# Altium schematic sheet IRComms.SchDoc
size A
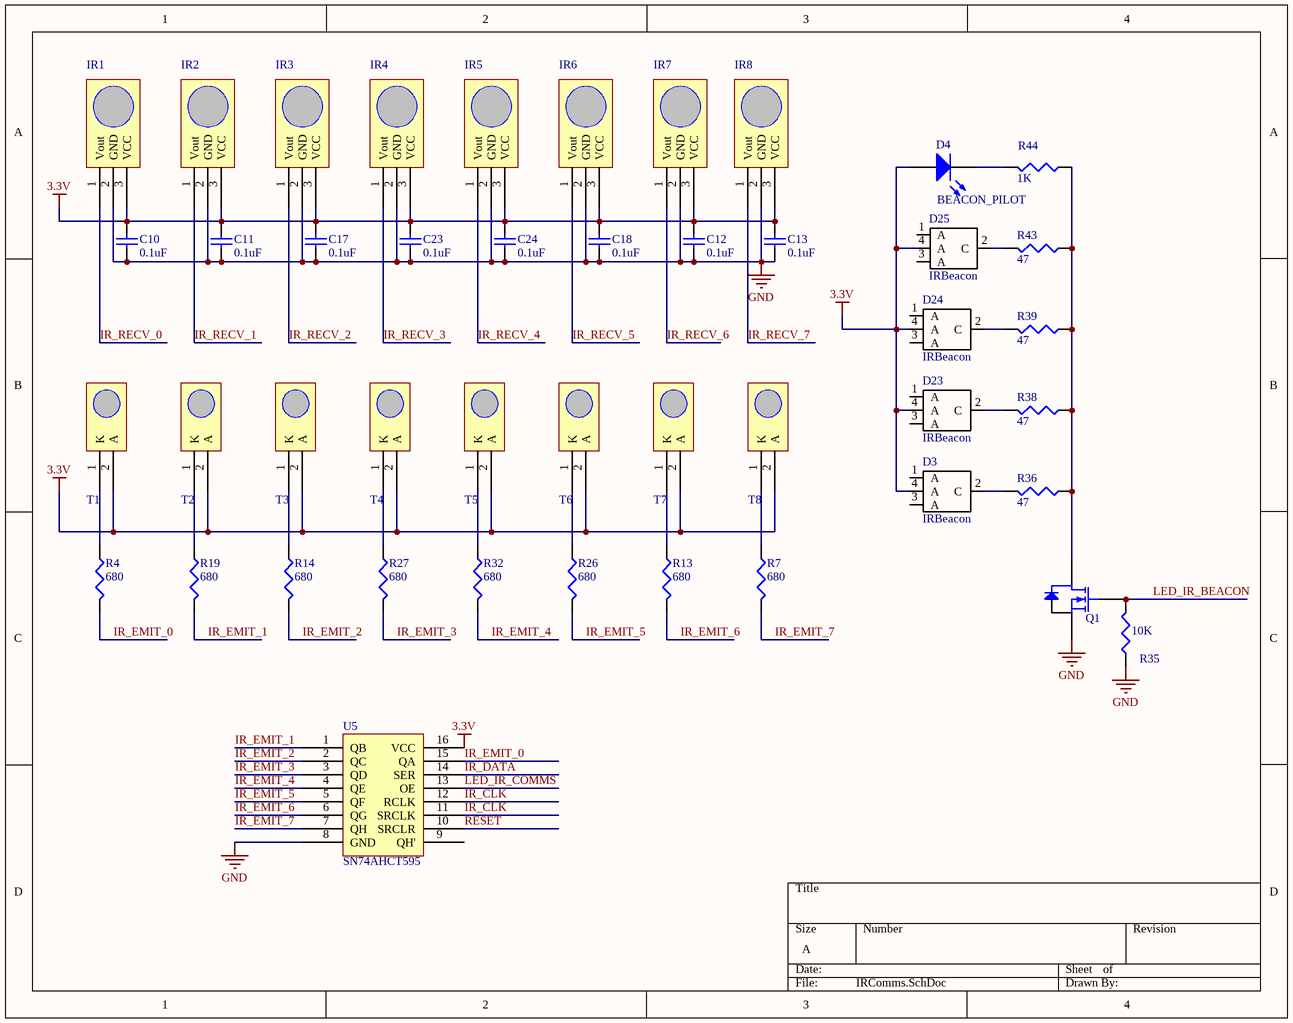
[diagram p0: IRComms.SchDoc]

## Parts
C10  value 0.1uF  [CAPC1005L]  (hidden comment: Cap Semi)
C11  value 0.1uF  [CAPC1005L]  (hidden comment: Cap Semi)
C12  value 0.1uF  [CAPC1005L]  (hidden comment: Cap Semi)
C13  value 0.1uF  [CAPC1005L]  (hidden comment: Cap Semi)
C17  value 0.1uF  [CAPC1005L]  (hidden comment: Cap Semi)
C18  value 0.1uF  [CAPC1005L]  (hidden comment: Cap Semi)
C23  value 0.1uF  [CAPC1005L]  (hidden comment: Cap Semi)
C24  value 0.1uF  [CAPC1005L]  (hidden comment: Cap Semi)
D3  IRBeacon  [IRBeacon]
D4  BEACON_PILOT  [SurfaceMount(603)]
D23  IRBeacon  [IRBeacon]
D24  IRBeacon  [IRBeacon]
D25  IRBeacon  [IRBeacon]
IR1  GP1UX31QS  [GP1UX31QS]  (value not drawn)
IR2  GP1UX31QS  [GP1UX31QS]  (value not drawn)
IR3  GP1UX31QS  [GP1UX31QS]  (value not drawn)
IR4  GP1UX31QS  [GP1UX31QS]  (value not drawn)
IR5  GP1UX31QS  [GP1UX31QS]  (value not drawn)
IR6  GP1UX31QS  [GP1UX31QS]  (value not drawn)
IR7  GP1UX31QS  [GP1UX31QS]  (value not drawn)
IR8  GP1UX31QS  [GP1UX31QS]  (value not drawn)
Q1  Mosfet  [SOT-23]  (value not drawn)
R4  value 680  [RESC1608L]  (hidden comment: Res3)
R7  value 680  [RESC1608L]  (hidden comment: Res3)
R13  value 680  [RESC1608L]  (hidden comment: Res3)
R14  value 680  [RESC1608L]  (hidden comment: Res3)
R19  value 680  [RESC1608L]  (hidden comment: Res3)
R26  value 680  [RESC1608L]  (hidden comment: Res3)
R27  value 680  [RESC1608L]  (hidden comment: Res3)
R32  value 680  [RESC1608L]  (hidden comment: Res3)
R35  value 10K  [RESC1608L]  (hidden comment: Res3)
R36  value 47  [RESC1608L]  (hidden comment: Res3)
R38  value 47  [RESC1608L]  (hidden comment: Res3)
R39  value 47  [RESC1608L]  (hidden comment: Res3)
R43  value 47  [RESC1608L]  (hidden comment: Res3)
R44  value 1K  [RESC1608L]  (hidden comment: Res3)
T1  LN54  [LN54]  (value not drawn)
T2  LN54  [LN54]  (value not drawn)
T3  LN54  [LN54]  (value not drawn)
T4  LN54  [LN54]  (value not drawn)
T5  LN54  [LN54]  (value not drawn)
T6  LN54  [LN54]  (value not drawn)
T7  LN54  [LN54]  (value not drawn)
T8  LN54  [LN54]  (value not drawn)
U5  SN74AHCT595  [TSOP65P640X120-16N]

## Nets
3.3V: C10.2 C11.2 C12.2 C13.2 C17.2 C18.2 C23.2 C24.2 D3.4(A) D4.1(A) D23.4(A) D24.4(A) D25.4(A) IR1.3(VCC) IR2.3(VCC) IR3.3(VCC) IR4.3(VCC) IR5.3(VCC) IR6.3(VCC) IR7.3(VCC) IR8.3(VCC) T1.2(A) T2.2(A) T3.2(A) T4.2(A) T5.2(A) T6.2(A) T7.2(A) T8.2(A) U5.16(VCC)
GND: C10.1 C11.1 C12.1 C13.1 C17.1 C18.1 C23.1 C24.1 IR1.2(GND) IR2.2(GND) IR3.2(GND) IR4.2(GND) IR5.2(GND) IR6.2(GND) IR7.2(GND) IR8.2(GND) Q1.2(S) R35.1 U5.8(GND)
IR_CLK: U5.11(SRCLK) U5.12(RCLK)
IR_DATA: U5.14(SER)
IR_EMIT_0: R4.2 U5.15(QA)
IR_EMIT_1: R19.2 U5.1(QB)
IR_EMIT_2: R14.2 U5.2(QC)
IR_EMIT_3: R27.2 U5.3(QD)
IR_EMIT_4: R32.2 U5.4(QE)
IR_EMIT_5: R26.2 U5.5(QF)
IR_EMIT_6: R13.2 U5.6(QG)
IR_EMIT_7: R7.2 U5.7(QH)
IR_RECV_0: IR1.1(Vout)
IR_RECV_1: IR2.1(Vout)
IR_RECV_2: IR3.1(Vout)
IR_RECV_3: IR4.1(Vout)
IR_RECV_4: IR5.1(Vout)
IR_RECV_5: IR6.1(Vout)
IR_RECV_6: IR7.1(Vout)
IR_RECV_7: IR8.1(Vout)
LED_IR_BEACON: Q1.1(G) R35.2
LED_IR_COMMS: U5.13(OE)
RESET: U5.10(SRCLR)
NetD3_2: D3.2(C) R36.2
NetD4_2: D4.2(K) R44.2
NetD23_2: D23.2(C) R38.2
NetD24_2: D24.2(C) R39.2
NetD25_2: D25.2(C) R43.2
NetQ1_3: Q1.3(D) R36.1 R38.1 R39.1 R43.1 R44.1
NetR4_1: R4.1 T1.1(K)
NetR7_1: R7.1 T8.1(K)
NetR13_1: R13.1 T7.1(K)
NetR14_1: R14.1 T3.1(K)
NetR19_1: R19.1 T2.1(K)
NetR26_1: R26.1 T6.1(K)
NetR27_1: R27.1 T4.1(K)
NetR32_1: R32.1 T5.1(K)

Not connected (* = marked no-connect by the designer): D3 1(A) 3(A); D23 1(A) 3(A); D24 1(A) 3(A); D25 1(A) 3(A); U5 9(QH')

## Library data of the parts
C10-C13 C17 C18 C23 C24 = Cap Semi: Capacitor (Semiconductor SIM Model); Published: 8-Jun-2000; LatestRevisionDate: 29-May-2009; LatestRevisionNote: IPC-7351 Footprint Added.; PackageReference: C1206; Publisher: Altium Limited; PackageDescription: Chip Capacitor
D4 = LED
R4 R7 R13 R14 R19 R26 R27 R32 R35 R36 R38 R39 R43 R44 = Res3: Resistor; Published: 8-Jun-2000; LatestRevisionDate: 29-May-2009; LatestRevisionNote: IPC-7351 Footprint Added.; PackageReference: J1-0603; Publisher: Altium Limited; PackageDescription: Chip Resistor
U5 = SN74AHCT595_Shift_Register